# Altium schematic sheet omni_wheel_car_frame.SchDoc
size A4
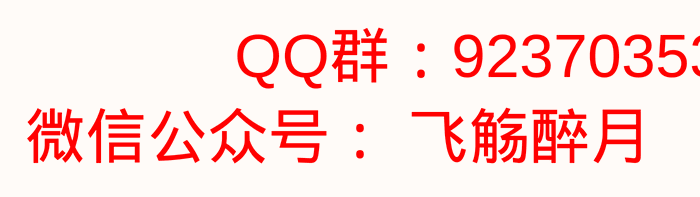
[diagram p0: omni_wheel_car_frame.SchDoc]

## Notes on the sheet
- QQ群：923703530
- 微信公众号： 飞觞醉月